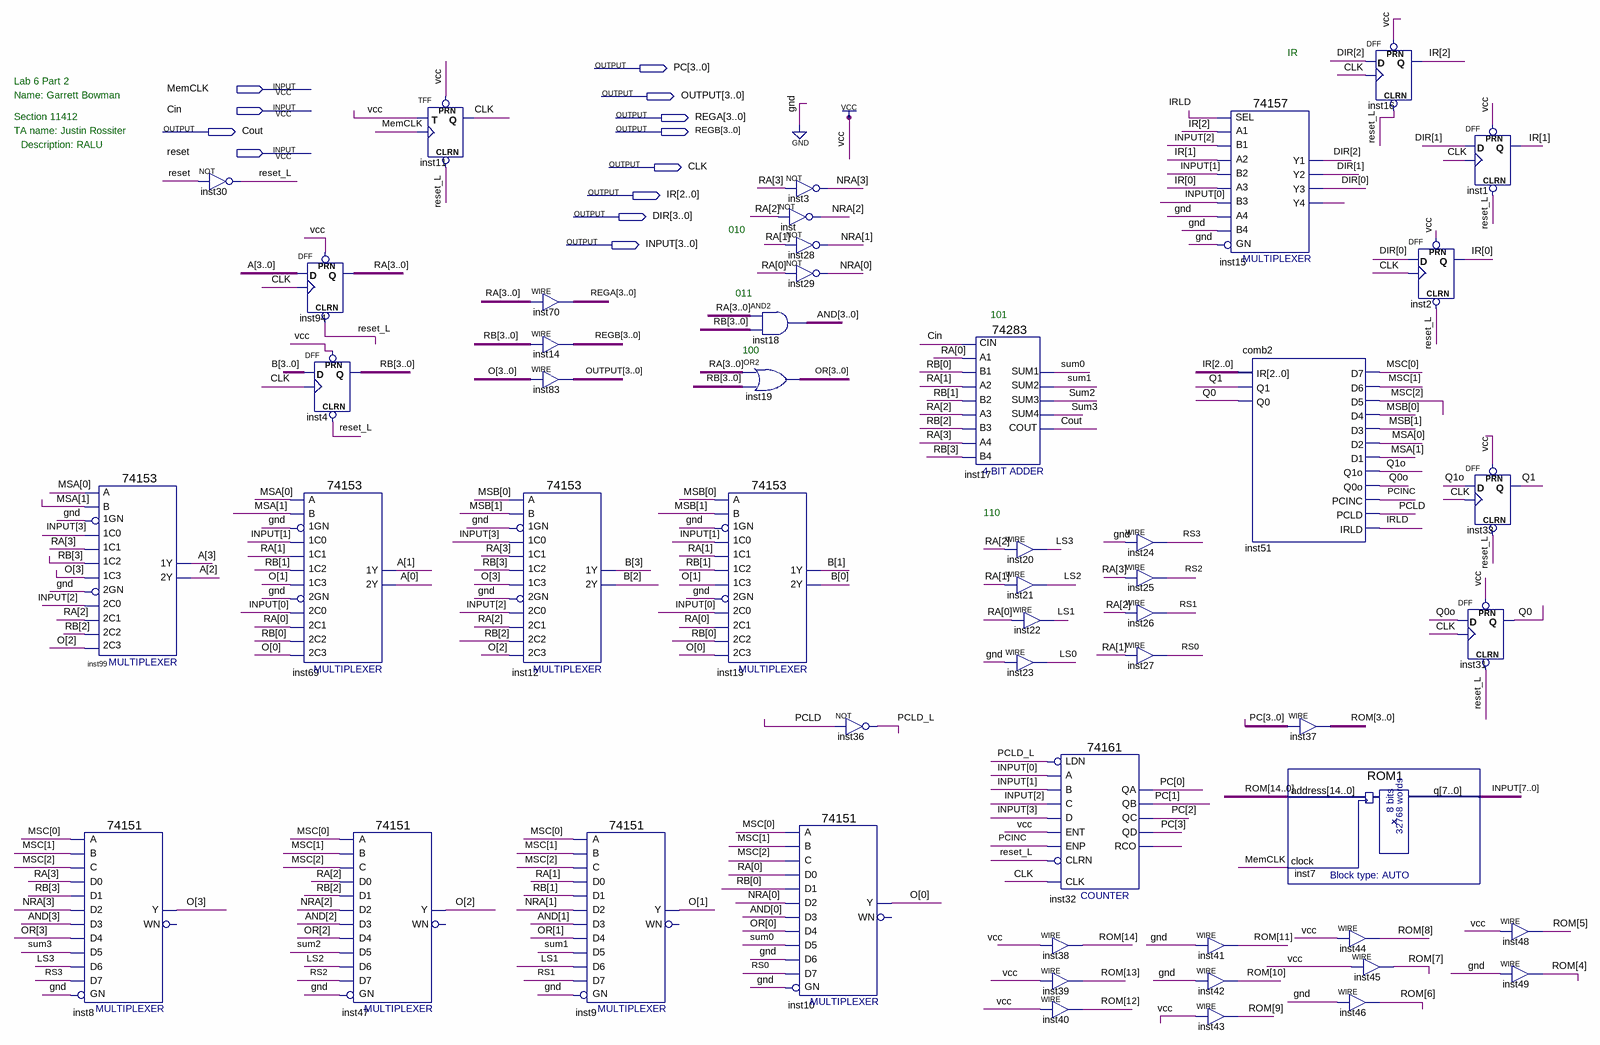
[diagram p0: schematic sheet]
// Quartus schematic LAB6_Part2.bdf as structural Verilog: 52 symbols, 12 pins
module LAB6_Part2 (
  input  MemCLK,
  input  Cin,
  input  reset,
  output [3:0] PC,
  output [3:0] OUTPUT,
  output [3:0] REGA,
  output Cout,
  output [3:0] REGB,
  output CLK,
  output [2:0] IR,
  output [3:0] DIR,
  output [7:0] INPUT
);

  wire inst15_y4, inst32_rco, IRLD, LS0, LS1, LS2, LS3, PCINC, PCLD, PCLD_L, Q0, Q0o, Q1, Q1o, reset_L, RS0,
       RS1, RS2, RS3, sum0, sum1, sum2, sum3;
  wire [1:0] MSA, MSB;
  wire [2:0] MSC;
  wire [3:0] A, AND, B, NRA, O, OR, RA, RB;
  wire [14:0] ROM;

  \74153  inst99 (
    .\1C1 (RA[3]), .\1GN (1'b0), .\1C0 (INPUT[3]), .\2C0 (INPUT[2]), .\2GN (1'b0), .\2C2 (RB[2]),
    .\1C2 (RB[3]), .\1C3 (O[3]), .B(MSA[1]), .A(MSA[0]), .\2C1 (RA[2]), .\2C3 (O[2]), .\1Y (A[3]), .\2Y (A[2]));
  \74151  inst8 (
    .GN(1'b0), .C(MSC[2]), .B(MSC[1]), .A(MSC[0]), .D5(sum3), .D0(RA[3]), .D1(RB[3]), .D4(OR[3]),
    .D3(AND[3]), .D2(NRA[3]), .D6(LS3), .D7(RS3), .Y(O[3]));  // open: WN
  not inst30 (reset_L, reset);
  DFF inst94[3:0] (.CLRN(reset_L), .CLK(CLK), .D(A), .PRN(1'b1), .Q(RA));
  DFF inst4[3:0] (.CLRN(reset_L), .CLK(CLK), .D(B), .PRN(1'b1), .Q(RB));
  \74153  inst69 (
    .\1C1 (RA[1]), .\1GN (1'b0), .\1C0 (INPUT[1]), .\2C0 (INPUT[0]), .\2GN (1'b0), .\2C2 (RB[0]),
    .\1C2 (RB[1]), .\1C3 (O[1]), .B(MSA[1]), .A(MSA[0]), .\2C1 (RA[0]), .\2C3 (O[0]), .\1Y (A[1]), .\2Y (A[0]));
  \74151  inst47 (
    .GN(1'b0), .C(MSC[2]), .B(MSC[1]), .A(MSC[0]), .D5(sum2), .D0(RA[2]), .D1(RB[2]), .D4(OR[2]),
    .D3(AND[2]), .D2(NRA[2]), .D6(LS2), .D7(RS2), .Y(O[2]));  // open: WN
  TFF inst11 (.PRN(1'b1), .CLRN(reset_L), .T(1'b1), .CLK(MemCLK), .Q(CLK));
  assign REGA = RA;  // WIRE inst70
  assign REGB = RB;  // WIRE inst14
  assign OUTPUT = O;  // WIRE inst83
  \74153  inst12 (
    .\1C1 (RA[3]), .\1GN (1'b0), .\1C0 (INPUT[3]), .\2C0 (INPUT[2]), .\2GN (1'b0), .\2C2 (RB[2]),
    .\1C2 (RB[3]), .\1C3 (O[3]), .B(MSB[1]), .A(MSB[0]), .\2C1 (RA[2]), .\2C3 (O[2]), .\1Y (B[3]), .\2Y (B[2]));
  \74151  inst9 (
    .GN(1'b0), .C(MSC[2]), .B(MSC[1]), .A(MSC[0]), .D5(sum1), .D0(RA[1]), .D1(RB[1]), .D4(OR[1]),
    .D3(AND[1]), .D2(NRA[1]), .D6(LS1), .D7(RS1), .Y(O[1]));  // open: WN
  \74153  inst13 (
    .\1C1 (RA[1]), .\1GN (1'b0), .\1C0 (INPUT[1]), .\2C0 (INPUT[0]), .\2GN (1'b0), .\2C2 (RB[0]),
    .\1C2 (RB[1]), .\1C3 (O[1]), .B(MSB[1]), .A(MSB[0]), .\2C1 (RA[0]), .\2C3 (O[0]), .\1Y (B[1]), .\2Y (B[0]));
  not inst3 (NRA[3], RA[3]);
  not inst (NRA[2], RA[2]);
  not inst28 (NRA[1], RA[1]);
  not inst29 (NRA[0], RA[0]);
  assign AND = RA & RB;  // AND2 inst18, 4 bits wide
  assign OR = RA | RB;  // OR2 inst19, 4 bits wide
  \74151  inst10 (
    .GN(1'b0), .C(MSC[2]), .B(MSC[1]), .A(MSC[0]), .D5(sum0), .D0(RA[0]), .D1(RB[0]), .D4(OR[0]),
    .D3(AND[0]), .D2(NRA[0]), .D6(1'b0), .D7(RS0), .Y(O[0]));  // open: WN
  not inst36 (PCLD_L, PCLD);
  \74283  inst17 (
    .CIN(Cin), .A1(RA[0]), .A2(RA[1]), .B2(RB[1]), .A3(RA[2]), .A4(RA[3]), .B4(RB[3]), .B1(RB[0]),
    .B3(RB[2]), .SUM4(sum3), .COUT(Cout), .SUM1(sum0), .SUM2(sum1), .SUM3(sum2));
  assign LS3 = RA[2];  // WIRE inst20
  assign LS2 = RA[1];  // WIRE inst21
  assign LS1 = RA[0];  // WIRE inst22
  assign LS0 = 1'b0;  // WIRE inst23
  \74161  inst32 (
    .CLRN(reset_L), .CLK(CLK), .ENP(PCINC), .LDN(PCLD_L), .A(INPUT[0]), .D(INPUT[3]), .ENT(1'b1),
    .B(INPUT[1]), .C(INPUT[2]), .QD(PC[3]), .QC(PC[2]), .QB(PC[1]), .QA(PC[0]), .RCO(inst32_rco));
  assign ROM[14] = 1'b1;  // WIRE inst38
  assign ROM[13] = 1'b1;  // WIRE inst39
  assign ROM[12] = 1'b1;  // WIRE inst40
  assign RS3 = 1'b0;  // WIRE inst24
  assign RS2 = RA[3];  // WIRE inst25
  assign RS1 = RA[2];  // WIRE inst26
  assign RS0 = RA[1];  // WIRE inst27
  \74157  inst15 (
    .A1(IR[2]), .B1(INPUT[2]), .SEL(IRLD), .B2(INPUT[1]), .A3(IR[0]), .B3(INPUT[0]), .A2(IR[1]), .B4(1'b0),
    .GN(1'b0), .A4(1'b0), .Y2(DIR[1]), .Y1(DIR[2]), .Y4(inst15_y4), .Y3(DIR[0]));
  comb2 inst51 (
    .IR(IR), .Q1(Q1), .Q0(Q0), .D7(MSC[0]), .D6(MSC[1]), .D5(MSC[2]), .D4(MSB[0]), .D3(MSB[1]), .D2(MSA[0]),
    .D1(MSA[1]), .Q1o(Q1o), .Q0o(Q0o), .PCINC(PCINC), .PCLD(PCLD), .IRLD(IRLD));
  assign ROM[11] = 1'b0;  // WIRE inst41
  assign ROM[10] = 1'b0;  // WIRE inst42
  assign ROM[9] = 1'b1;  // WIRE inst43
  assign ROM[3:0] = PC;  // WIRE inst37
  ROM1 inst7 (.address(ROM), .clock(MemCLK), .q(INPUT));
  assign ROM[8] = 1'b1;  // WIRE inst44
  assign ROM[7] = 1'b1;  // WIRE inst45
  assign ROM[6] = 1'b0;  // WIRE inst46
  DFF inst16 (.CLRN(reset_L), .CLK(CLK), .D(DIR[2]), .PRN(1'b1), .Q(IR[2]));
  DFF inst2 (.CLRN(reset_L), .CLK(CLK), .D(DIR[0]), .PRN(1'b1), .Q(IR[0]));
  DFF inst1 (.CLRN(reset_L), .CLK(CLK), .D(DIR[1]), .PRN(1'b1), .Q(IR[1]));
  DFF inst33 (.CLRN(reset_L), .CLK(CLK), .D(Q1o), .PRN(1'b1), .Q(Q1));
  DFF inst31 (.CLRN(reset_L), .CLK(CLK), .D(Q0o), .PRN(1'b1), .Q(Q0));
  assign ROM[5] = 1'b1;  // WIRE inst48
  assign ROM[4] = 1'b0;  // WIRE inst49

  // Notes on the sheet:
  //   IR
  //   Lab 6 Part 2
  //   Name: Garrett Bowman
  //   Section 11412
  //   TA name: Justin Rossiter
  //   Description: RALU
  //   010
  //   011
  //   101
  //   100
  //   110
endmodule
